# EAGLE schematic Exterior (EAGLE 6.4)
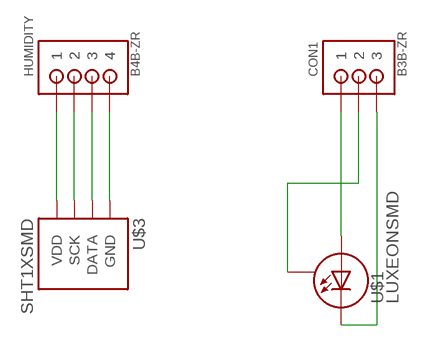
[diagram p0: schematic, sheet 1]

## Parts
CON1  B3B-ZR  [B3B-ZR]
HUMIDITY  B4B-ZR  [B4B-ZR]
U$1  LUXEONSMD  [LUXEON]
U$3  SHT1XSMD  [SHT1X]

## Nets
N$1: CON1.2 U$1.S
N$2: HUMIDITY.3 U$3.2(DATA)
N$3: HUMIDITY.4 U$3.1(GND)
N$4: CON1.1 U$1.A
N$5: CON1.3 U$1.C
N$6: HUMIDITY.2 U$3.3(SCK)
N$7: HUMIDITY.1 U$3.4(VDD)

## Library data of the parts
CON1 = jst:B3B-ZR: JST-ZH Connector 3 pol, 1.5mm pitch Package: B3B-ZR Source: http://www.jst-mfg.com/product/pdf/eng/eZH.pdf
HUMIDITY = jst:B4B-ZR: JST-ZH Connector 4 pol, 1.5mm pitch Package: B4B-ZR Source: http://www.jst-mfg.com/product/pdf/eng/eZH.pdf
U$1 = SparkFun-LED:LUXEON: Luxeon LED This footprint works with the current 1 Watt, 3 Watt, and 5 Watt LEDs. These blindingly bright LEDs generate a lot of heat so the footprint has a large pad under the LED for thermal transfer. Schematic and footprint are proven. Spark Fun Electronics SKU : COM-00603
U$3 = SparkFun-Sensors:SHT1X: SHT1x Humdity Sensor Sensirion humdity sensor. Schematic element and footprint proven. Spark Fun Electronics SKU : COM-08227